# EAGLE design motadora (EAGLE 8.3.1)
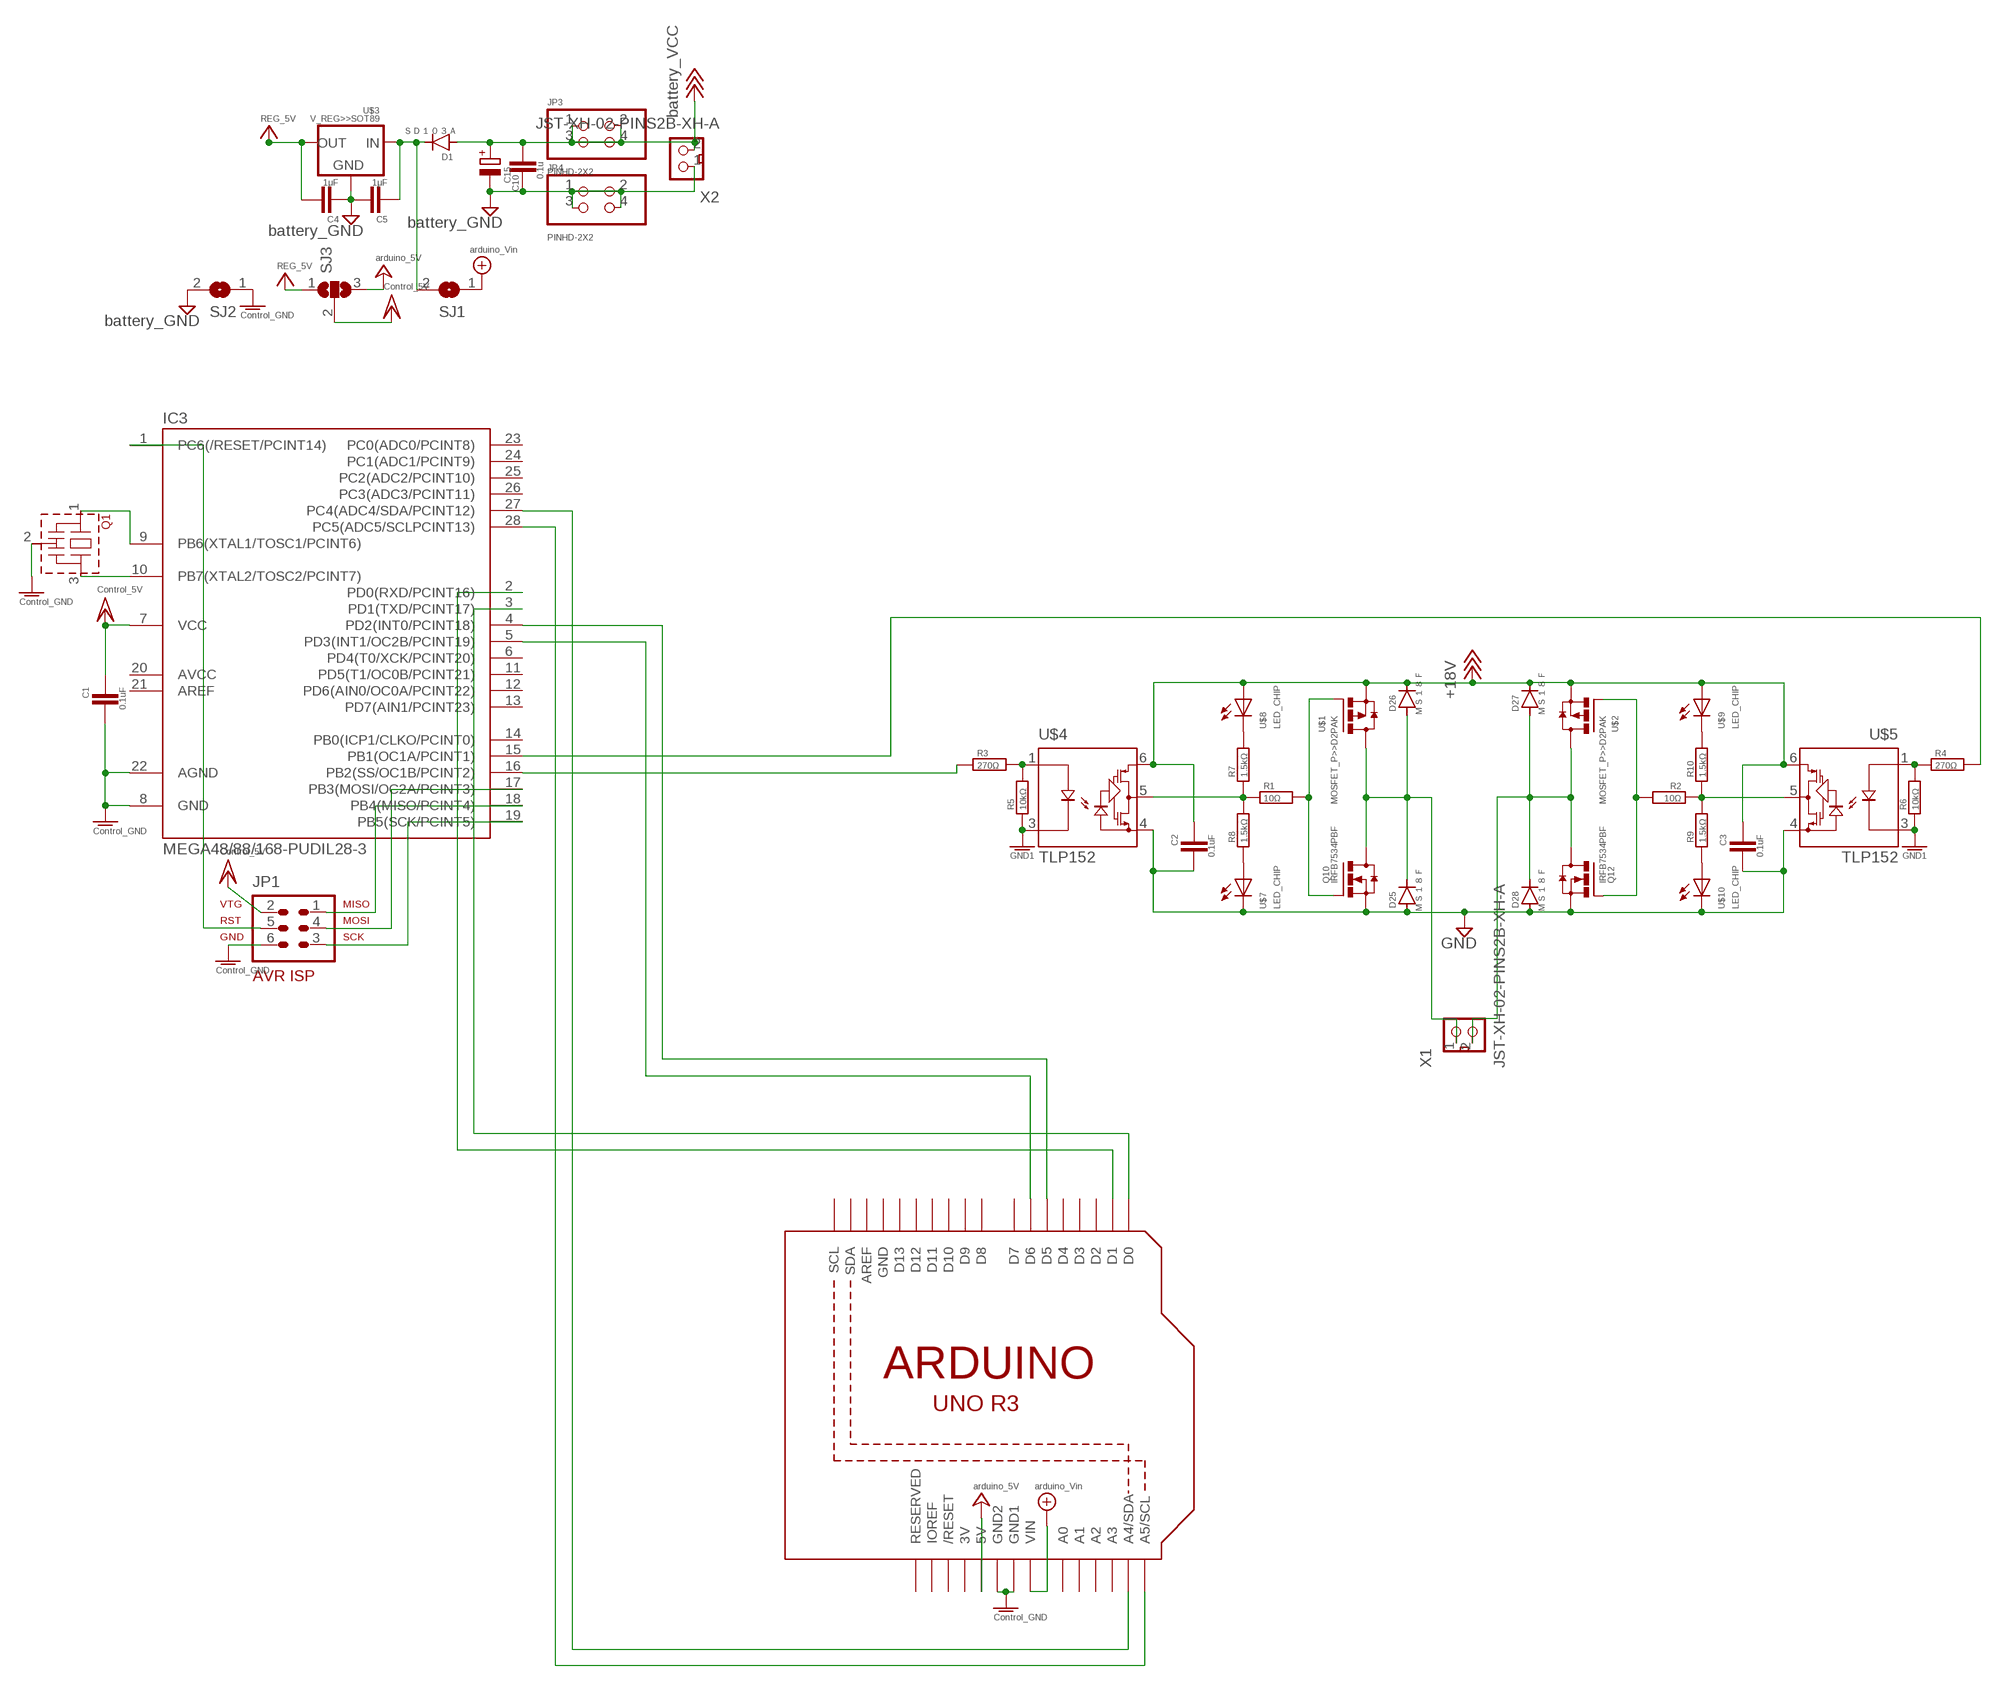
[diagram p0: schematic, sheet 1]

## Parts
C1  0.1uF  CAPACITOR>>2012  [2012]
C2  0.1uF  CAPACITOR>>2012  [2012]
C3  0.1uF  CAPACITOR>>2012  [2012]
C4  1μF  C>>C2012  [C2012]
C5  1μF  C>>C2012  [C2012]
C10  0.1u  C-EU025-025X050  [C025-025X050]
C15  CPOL-EUTT2D5L  [TT2D5L]
D1  ＳＤ１０３Ａ  DIODE>>D-7.5  [D-7.5]
D25  ＭＳ１８Ｆ  DIODE>>MS18F  [MS18F]
D26  ＭＳ１８Ｆ  DIODE>>MS18F  [MS18F]
D27  ＭＳ１８Ｆ  DIODE>>MS18F  [MS18F]
D28  ＭＳ１８Ｆ  DIODE>>MS18F  [MS18F]
IC3  MEGA48/88/168-PUDIL28-3  [DIL28-3]
JP1  AVR-ISP-6  [AVR-ISP-6]
JP3  PINHD-2X2  [2X02]
JP4  PINHD-2X2  [2X02]
Q1  CSTLS_G  [CSTLS_G8]
Q10  IRFB7534PBF  MOS-FET_N(D2PACK)  [D2PACK]
Q12  IRFB7534PBF  MOS-FET_N(D2PACK)  [D2PACK]
R1  10Ω  REGISTER>>2012  [2012]
R2  10Ω  REGISTER>>2012  [2012]
R3  270Ω  REGISTER>>2012  [2012]
R4  270Ω  REGISTER>>2012  [2012]
R5  10kΩ  REGISTER>>2012  [2012]
R6  10kΩ  REGISTER>>2012  [2012]
R7  1.5kΩ  REGISTER>>2012  [2012]
R8  1.5kΩ  REGISTER>>2012  [2012]
R9  1.5kΩ  REGISTER>>2012  [2012]
R10  1.5kΩ  REGISTER>>2012  [2012]
SJ1  SJ  [SJ]
SJ2  SJ  [SJ]
SJ3  SJ2W  [SJ_2]
U1  ARDUINOR3-BPLACE  [ARDUINOR3-BPLACE]
U$1  MOSFET_P>>D2PAK  [D2PAK]
U$2  MOSFET_P>>D2PAK  [D2PAK]
U$3  V_REG>>SOT89  [SOT89]
U$4  TLP152  [11-4L1S]
U$5  TLP152  [11-4L1S]
U$7  LED_CHIP  [2012]
U$8  LED_CHIP  [2012]
U$9  LED_CHIP  [2012]
U$10  LED_CHIP  [2012]
X1  JST-XH-02-PINS2B-XH-A  2_S2B-XH-A  [S2B-XH-A]
X2  JST-XH-02-PINS2B-XH-A  2_S2B-XH-A  [S2B-XH-A]

## Nets
+5V: C4.1 SJ3.1 U$3.1(OUT) ; supply symbol labelled REG_5V
+18V: C2.2 C3.2 C10.1 C15.+ D1.A D26.P$2(C) D27.P$2(C) JP3.1 JP3.2 JP3.3 JP3.4 U$1.3(S) U$2.3(S) U$4.6 U$5.6 U$8.P$1(A) U$9.P$1(A) X2.2 ; supply symbol labelled battery_VCC
GND: C2.1 C3.1 C4.2 C5.1 C10.2 C15.- D25.P$1(A) D28.P$1(A) JP4.1 JP4.2 JP4.3 JP4.4 Q10.3(S) Q12.3(S) SJ2.2 U$3.2(GND) U$3.2.1(GND) U$4.4 U$5.4 U$7.P$2(C) U$10.P$2(C) X2.1 ; supply symbol labelled battery_GND
GND1: C1.1 IC3.8(GND) IC3.22(AGND) JP1.6 Q1.2(VSS) R5.1 R6.1 SJ2.1 U1.GND1 U1.GND2 U$4.3 U$5.3 ; supply symbol labelled Control_GND
N$1: R2.1 R9.2 R10.1 U$5.5
N$2: Q12.1(G) R2.2 U$2.1(G)
N$3: IC3.28(PC5(ADC5/SCLPCINT13)) U1.A5(A5/SCL)
N$4: R3.2 R5.2 U$4.1
N$5: R1.1 R7.1 R8.2 U$4.5
N$6: R4.1 R6.2 U$5.1
N$7: IC3.17(PB3(MOSI/OC2A/PCINT3)) JP1.4
N$8: IC3.27(PC4(ADC4/SDA/PCINT12)) U1.A4(A4/SDA)
N$9: IC3.10(PB7(XTAL2/TOSC2/PCINT7)) Q1.3
N$10: IC3.3(PD1(TXD/PCINT17)) U1.D0
N$11: IC3.2(PD0(RXD/PCINT16)) U1.D1
N$13: C5.2 D1.C SJ1.2 U$3.3(IN)
N$15: D25.P$2(C) D26.P$1(A) Q10.2(D) U$1.4(D) X1.1
N$17: R7.2 U$8.P$2(C)
N$18: IC3.9(PB6(XTAL1/TOSC1/PCINT6)) Q1.1
N$19: R8.1 U$7.P$1(A)
N$20: IC3.1(PC6(/RESET/PCINT14)) JP1.5
N$21: Q10.1(G) R1.2 U$1.1(G)
N$22: R9.1 U$10.P$1(A)
N$23: R10.2 U$9.P$2(C)
N$24: D27.P$1(A) D28.P$2(C) Q12.2(D) U$2.4(D) X1.2
N$26: IC3.19(PB5(SCK/PCINT5)) JP1.3
N$50: IC3.4(PD2(INT0/PCINT18)) U1.D5
N$51: IC3.5(PD3(INT1/OC2B/PCINT19)) U1.D6
N$55: IC3.18(PB4(MISO/PCINT4)) JP1.1
N$57: IC3.16(PB2(SS/OC1B/PCINT2)) R3.1
N$58: IC3.15(PB1(OC1A/PCINT1)) R4.2
VCC5: SJ3.3 U1.5V ; supply symbol labelled arduino_5V
VCC6: SJ1.1 U1.VIN ; supply symbol labelled arduino_Vin
VCC7: C1.2 IC3.7(VCC) JP1.2 SJ3.2 ; supply symbol labelled Control_5V
Unconnected: IC3.6(PD4(T0/XCK/PCINT20)) IC3.11(PD5(T1/OC0B/PCINT21)) IC3.12(PD6(AIN0/OC0A/PCINT22)) IC3.13(PD7(AIN1/PCINT23)) IC3.14(PB0(ICP1/CLKO/PCINT0)) IC3.20(AVCC) IC3.21(AREF) IC3.23(PC0(ADC0/PCINT8)) IC3.24(PC1(ADC1/PCINT9)) IC3.25(PC2(ADC2/PCINT10)) IC3.26(PC3(ADC3/PCINT11)) U1.A0 U1.A1 U1.A2 U1.A3 U1.AREF U1.D2 U1.D3 U1.D4 U1.D7 U1.D8 U1.D9 U1.D10 U1.D11 U1.D12 U1.D13 U1.IOREF U1.RESERVED U1.RESET(/RESET) U1.SCL U1.SDA

## Power pins joined to a net without a drawn wire
3V: U1.3V
GND: U1.GND

## Library data of the parts
C1-C3 = !SMD:CAPACITOR>>
C4 C5 = !Capasiter:C>>: CAPACITOR, European symbol
C10 = _capasiter:C-EU: CAPACITOR, European symbol
C15 = _Capasiter(ｺﾝﾃﾞﾝｻ):CPOL-EU: POLARIZED CAPACITOR, European symbol
D1 D25-D28 = !diode(ﾀﾞｲｵｰﾄﾞ):DIODE>>: DIODE
IC3 = !avr:MEGA48/88/168-PU
JP1 = !avr:AVR-ISP-6: AVR ISP-6 Serial Programming Header
JP3 JP4 = _pinhead(ﾋﾟﾝﾍｯﾀﾞ):PINHD-2X2: PIN HEADER
Q1 = !murata-resonators(ｾﾗﾛｯｸ):CSTLS_G: Ceramic resonator 2.00 to 10.00 MHz
Q10 Q12 = _FET&transister&v-reg:MOS-FET_N
R1-R10 = !SMD:REGISTER>>
SJ1 SJ2 = jumper:SJ: SMD solder JUMPER
SJ3 = jumper:SJ2W: SMD solder JUMPER
U1 = adafruit:ARDUINOR3: This is a new object for the new Arduino R3 - with extra pins that you may want to use (such as IOref, and duplicated A4/A5
U$1 U$2 = !FET_transister_v-reg:MOSFET_P>>
U$3 = !FET_transister_v-reg:V_REG>>
U$4 U$5 = !optocoupler(ﾌｫﾄｶﾌﾟﾗ):TLP152
U$7-U$10 = !led:LED_CHIP
X1 X2 = !con-xh:2_: Wire-to-Board 2.5mm pitch top mount connector Source: http://www.jst-mfg.com/product/pdf/jpn/XH.pdf http://www.jst-mfg.com/product/detail.php?series=277

## Board
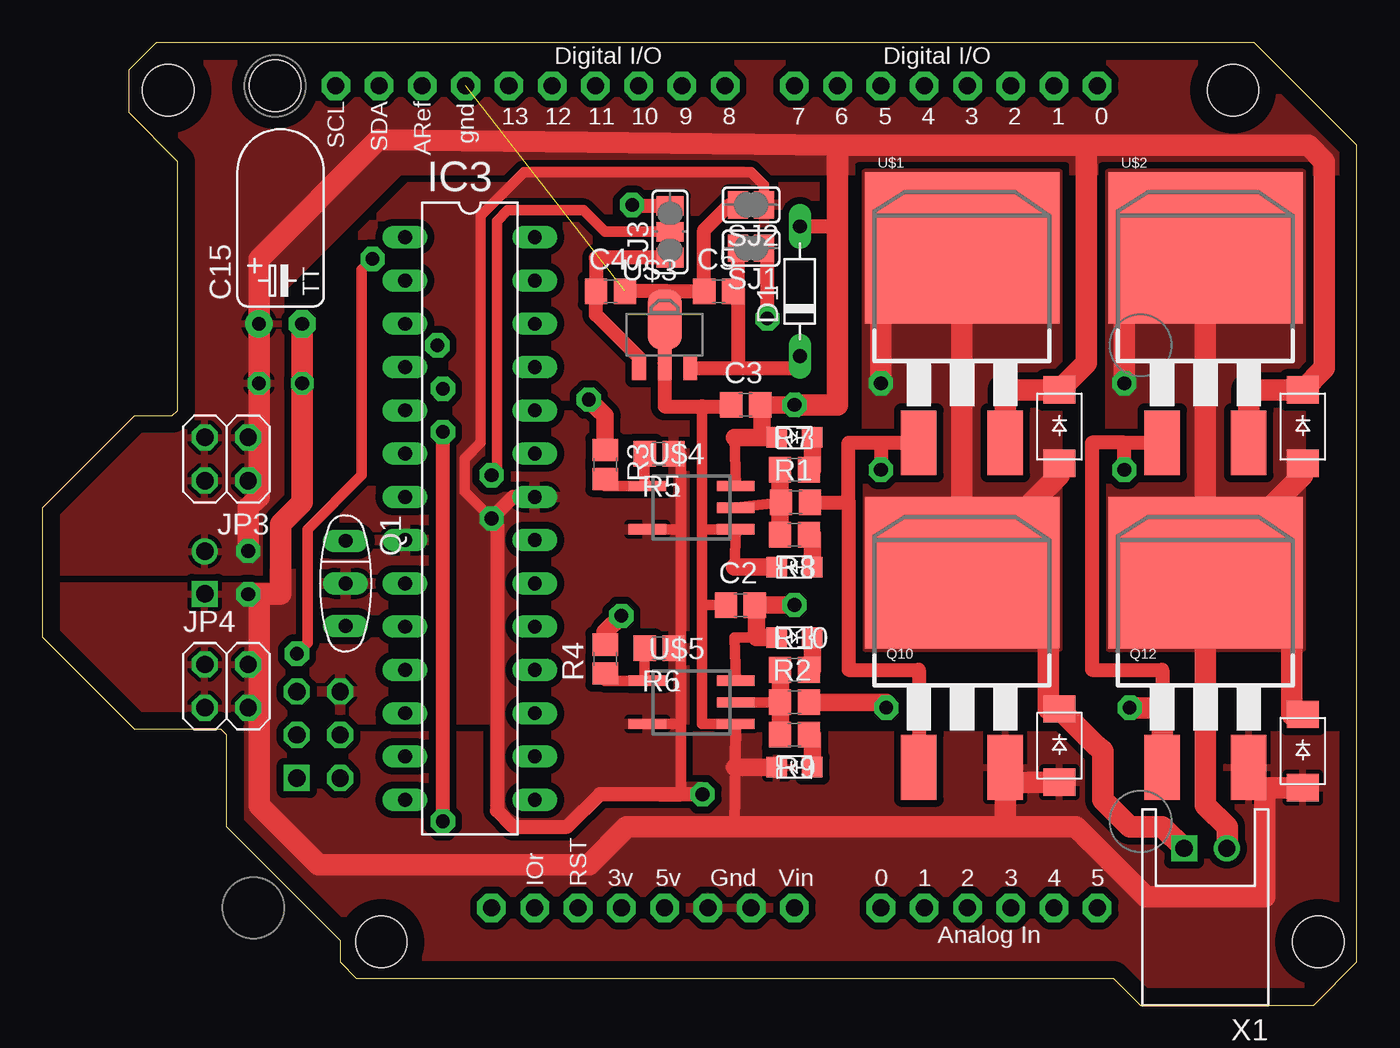
[diagram p1: board, top side]
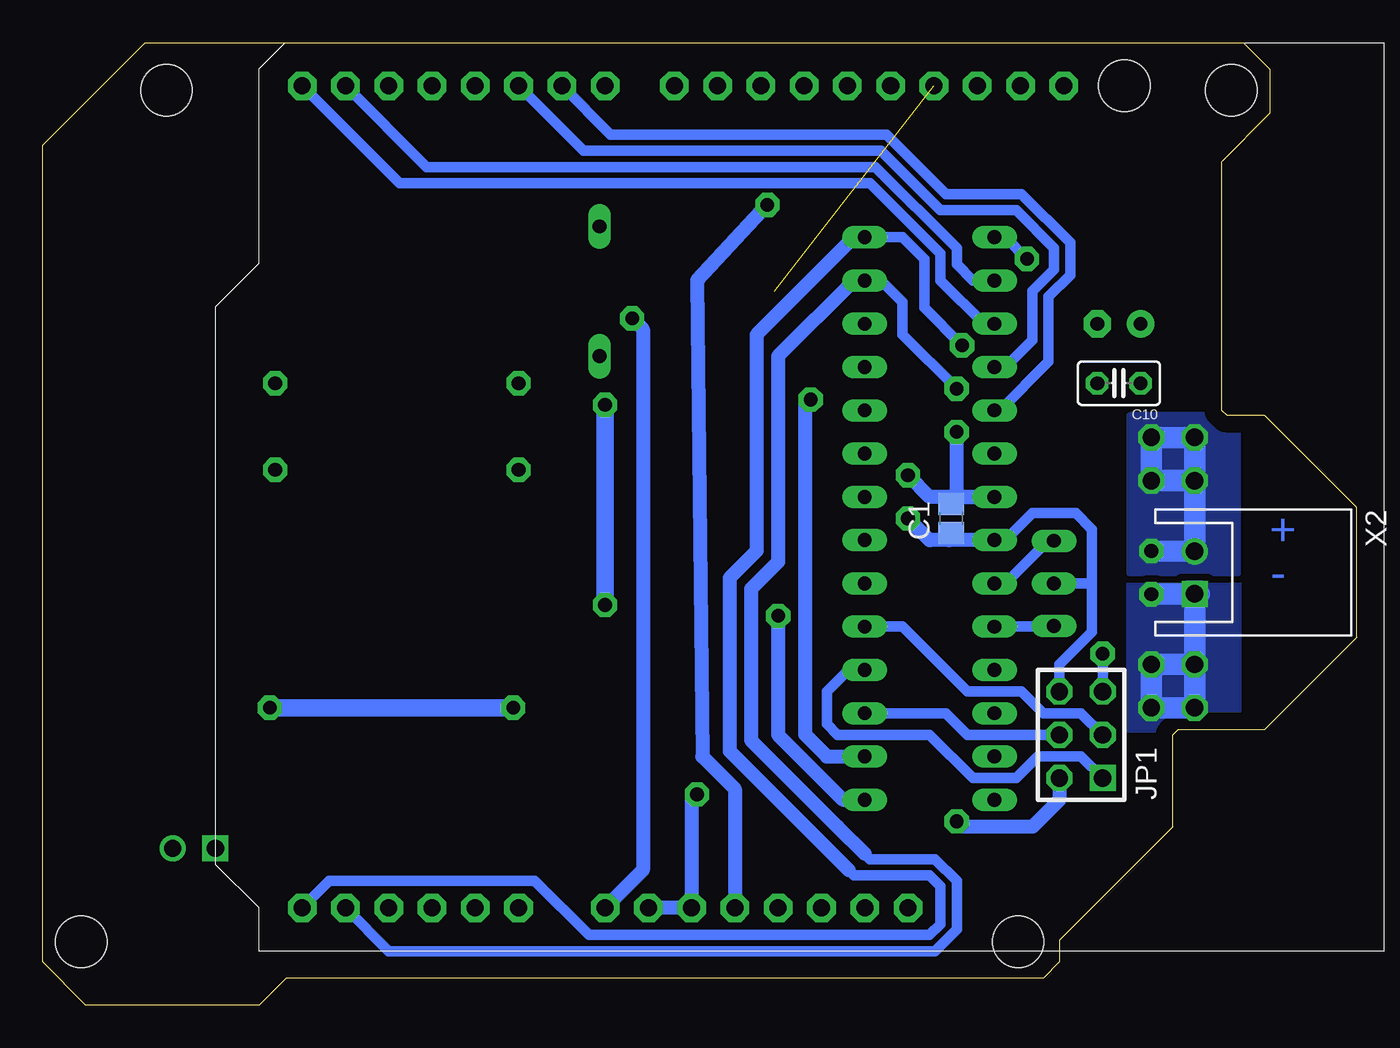
[diagram p2: board, bottom side, seen from below]

Size 77.15 x 56.52 mm. Coordinates in mm from the lower left corner, seen from the top.
Outline: 10.8,10.48 10.8,15.88 10.48,16.19 5.4,16.19 0,21.59 0,29.21 5.4,34.61 7.62,34.61 7.94,34.92 7.94,49.53 5.08,52.39 5.08,54.93 6.67,56.52 71.12,56.52 77.15,50.48 77.15,2.54 74.61,0 64.45,0 62.87,1.59 18.41,1.59 17.46,2.54 17.46,3.81 10.8,10.48
Copper layers (1*16): Top 0.035mm / dielectric 1.5mm / Bottom 0.035mm
Design rules "default *": minimum track width 10mil, minimum drill 24mil, track to track 8mil, track to pad 8mil, pad to pad 8mil, via to via 8mil, smd to smd 8mil, copper to edge 40mil, drill to drill 8mil, minimum pad ring 10mil, minimum via ring 8mil, stop-mask expansion 4mil, vias tented up to drill 0mil, thermal gap 10mil
Holes 3 mm at 13.65,53.97 74.88,3.71 69.88,53.72 7.38,53.72 19.88,3.71

### Footprints (pad centres in the part's own frame; a part is rotated, then mirrored left to right if it is on the bottom)
2012 = smd 1.3 x 1.5: 1 -0.85,0; 2 0.85,0
C2012 = smd 1.3 x 1.5: 1 -0.85,0; 2 0.85,0
C025-025X050 = drill 0.813 octagon: 1 -1.27,0; 2 1.27,0
TT2D5L = drill 0.813 pad 1.6: + -1.27,0 | drill 0.813 pad 1.6 octagon: - 1.27,0
D-7.5 = drill 0.813 long: A 3.81,0; C -3.81,0
MS18F = smd 1.6 x 1.9: P$1 -2.15,0; P$2 2.15,0
DIL28-3 = drill 0.813 long: 1 -16.51,-3.81; 2 -13.97,-3.81; 3 -11.43,-3.81; 4 -8.89,-3.81; 5 -6.35,-3.81; 6 -3.81,-3.81; 7 -1.27,-3.81; 8 1.27,-3.81; 9 3.81,-3.81; 10 6.35,-3.81; 11 8.89,-3.81; 12 11.43,-3.81; 13 13.97,-3.81; 14 16.51,-3.81; 15 16.51,3.81; 16 13.97,3.81; 17 11.43,3.81; 18 8.89,3.81; 19 6.35,3.81; 20 3.81,3.81; 21 1.27,3.81; 22 -1.27,3.81; 23 -3.81,3.81; 24 -6.35,3.81; 25 -8.89,3.81; 26 -11.43,3.81; 27 -13.97,3.81; 28 -16.51,3.81
AVR-ISP-6 = drill 1.016 square: 1 -2.54,-1.27 | drill 1.016 octagon: 2 -2.54,1.27; 3 0,-1.27; 4 0,1.27; 5 2.54,-1.27; 6 2.54,1.27
2X02 = drill 1.016 octagon: 1 -1.27,-1.27; 2 -1.27,1.27; 3 1.27,-1.27; 4 1.27,1.27
CSTLS_G8 = drill 0.813 long: 1 -2.5,0; 2 0,0; 3 2.5,0
D2PACK = smd 2.083 x 3.81: 1 -2.54,-9.525; 3 2.54,-9.525 | smd 11.43 x 8.89: 2 0,1.905
SJ = smd 1.168 x 1.6: 1 -0.762,0; 2 0.762,0
SJ_2 = smd 1.168 x 1.6: 1 -1.524,0; 2 0,0; 3 1.524,0
ARDUINOR3-BPLACE = drill 1 pad 1.676 octagon: 3V 35.56,2.54; 5V 38.1,2.54; A0 50.8,2.54; A1 53.34,2.54; A2 55.88,2.54; A3 58.42,2.54; A4 60.96,2.54; A5 63.5,2.54; AREF 23.876,50.8; D0 63.5,50.8; D1 60.96,50.8; D2 58.42,50.8; D3 55.88,50.8; D4 53.34,50.8; D5 50.8,50.8; D6 48.26,50.8; D7 45.72,50.8; D8 41.656,50.8; D9 39.116,50.8; D10 36.576,50.8; D11 34.036,50.8; D12 31.496,50.8; D13 28.956,50.8; GND 26.416,50.8; GND1 43.18,2.54; GND2 40.64,2.54; IOREF 30.48,2.54; RESERVED 27.94,2.54; RESET 33.02,2.54; SCL 18.796,50.8; SDA 21.336,50.8; VIN 45.72,2.54
D2PAK = smd 2.083 x 3.81: 1 -2.54,-8.89; 3 2.54,-8.89 | smd 11.43 x 8.89: 4 0,2.54
SOT89 = smd 0.8 x 1.4: 1 -1.499,-1.981; 3 1.499,-1.981 | smd 0.8 x 1.9: 2 0,-1.727 | smd 2 x 3.5: 2.1 0,0.889
11-4L1S = smd 0.6 x 2.2: 1 -1.27,-2.6; 3 1.27,-2.6; 4 1.27,2.6; 5 0,2.6; 6 -1.27,2.6
2012' = smd 1.2 x 1.2: P$1 -1.05,0; P$2 1.05,0
S2B-XH-A = drill 1.016 square: 1 1.25,0 | drill 1.016: 2 -1.25,0

### Placement (x,y rotation side)
C1  23.81,28.57 90 bottom
C2  40.96,23.5 0 top
C3  41.27,35.24 0 top
C4  33.34,41.91 0 top
C5  39.69,41.91 0 top
C10  13.97,36.51 180 bottom
C15  13.97,40 0 top
D1  44.45,41.91 90 top
D25  59.69,15.24 90 top
D26  59.69,33.97 90 top
D27  73.98,33.97 90 top
D28  73.98,14.92 90 top
IC3  25.08,28.57 270 top
JP1  16.19,15.88 90 bottom
JP3  10.79,32.07 180 top
JP4  10.79,18.73 0 top
Q1  17.78,24.77 270 top
Q10  53.98,23.5 0 top
Q12  68.26,23.5 0 top
R1  44.2,29.53 0 top
R2  44.13,17.78 0 top
R3  33.02,31.75 270 top
R4  33.02,20.32 90 top
R5  36.2,32.39 180 top
R6  36.2,20.95 180 top
R7  44.13,31.43 0 top
R8  44.13,27.62 180 top
R9  44.13,15.88 180 top
R10  44.13,19.69 0 top
SJ1  41.59,44.45 180 top
SJ2  41.59,46.99 180 top
SJ3  36.83,45.4 90 top
U1  -1.59,3.17 0 top
U$1  53.98,41.91 0 top
U$2  68.26,41.91 0 top
U$3  36.51,39.37 0 top
U$4  38.1,29.21 270 top
U$5  38.1,17.78 270 top
U$7  LED_CHIP  [2012']  44.13,25.72 180 top
U$8  LED_CHIP  [2012']  44.13,33.34 0 top
U$9  LED_CHIP  [2012']  44.13,21.59 0 top
U$10  LED_CHIP  [2012']  44.13,13.97 180 top
X1  68.26,9.21 180 top
X2  9.53,25.4 270 bottom

### Tracks (layer width: path | path; a pad name or v marks a point on that pad's centre or on a via)
+5V
  Top 0.813: SJ3.1 32.49,43.88 C4.1 32.49,40.54 35.01,38.01 U$3.1
+18V  (via drill 0.8 pad 1.42)
  Top 0.61: 70.8,31.82 U$2.3 | 56.52,31.82 U$1.3 | U$4.6 40.63,33.34 | 41.91,21.59 40.63,21.59 U$5.6
  Top 0.813: 46.67,46.04 46.67,45.72 D1.A
  Top 1.016: U$9.P$1 41.91,21.59 41.91,23.5 | U$8.P$1 42.22,33.34 | 42.22,33.34 40.63,33.34 | v44.13,35.24 C3.2 42.23,35.24 42.22,33.34 | 41.91,23.5 v44.13,23.5 | 41.91,23.5 C2.2
  Top 1.27: 61.28,50.48 74.3,50.48 75.25,49.53 75.25,37.39 D27.P$2 70.8,36.12 U$2.3 | 61.28,50.48 61.28,37.71 D26.P$2 56.52,36.12 U$1.3 | 61.28,50.48 46.67,50.48 | 46.67,50.48 46.67,46.04 46.67,35.24 v44.13,35.24 | 46.67,50.48 19.69,50.8 12.7,43.81 C15.+ C10.1 12.7,29.84 12.06,29.21 v12.06,26.67 | 9.53,26.67 X2.2
  Bottom 1.016: v44.13,23.5 v44.13,35.24
  Bottom 1.27: JP3.3 JP3.1 JP3.2 JP3.4 | JP3.3 JP3.4 | JP3.3 9.53,32.61 | JP3.4 9.53,31.65 | JP3.4 9.53,26.67 | v12.06,26.67 X2.2
  pour Top (isolate 0.406, rank 4): 13.97,25.4 -0.32,25.4 -0.32,56.83 77.47,56.83 77.47,48.89 20.95,48.89 13.97,41.91
  pour Bottom (isolate 0.406, rank 4, no thermals): 6.99,25.4 6.99,34.61 13.34,34.61 13.34,25.4
GND  (via drill 0.8 pad 1.42)  (1 unrouted)
  Top 0.61: 71.76,12.77 Q12.3 | 56.52,13.09 Q10.3 | U$5.4 38.72,16.51 38.72,23.5 | 38.72,27.94 U$4.4 40.63,25.72 | 38.72,27.94 38.72,35.16 | 40.63,13.97 U$5.4 | 38.72,23.5 C2.1 | 38.72,23.5 38.72,27.94 | 40.63,10.48 U$5.4
  Top 0.813: U$3.2 36.51,35.16 38.72,35.16 40.43,35.16 C3.1 | SJ2.2 40.32,46.99 38.84,45.5 C5.1 36.72,41.91 | 36.72,41.91 C4.2 | 36.72,41.91 36.83,41.8 U$3.2.1 U$3.2 | U$3.2 36.51,37.73
  Top 1.016: U$7.P$2 40.63,25.72 | 40.63,13.97 U$10.P$2
  Top 1.27: D25.P$1 56.52,13.09 | D28.P$1 71.76,12.77 71.76,6.35 64.77,6.35 60.64,10.48 56.52,10.48 | Q10.3 56.52,10.48 | 56.52,10.48 40.63,10.48 34.29,10.48 32.07,8.25 16.19,8.25 12.7,11.75 12.7,24.13 | X2.1 9.53,24.18 | 13.76,24.13 13.97,24.13 13.97,24.34 | 13.97,24.34 13.97,28.26 15.24,29.53 C10.2 C15.- | v12.06,24.13 12.7,24.13 | 12.7,24.13 13.76,24.13 | 13.76,24.13 13.97,24.34
  Bottom 1.27: JP4.2 JP4.4 JP4.3 JP4.1 | JP4.1 JP4.2 | JP4.2 9.53,24.18 9.25,24.13 v12.06,24.13 X2.1 | JP4.2 9.53,19.14 | JP4.1 9.53,18.37
  pour Top (isolate 0.406, rank 5): -0.32,-0.32 77.47,-0.32 77.47,15.88 14.92,15.88 14.92,25.4 -0.32,25.4
  pour Bottom (isolate 0.406, rank 5, no thermals): 6.99,25.4 6.99,16.19 13.34,16.19 13.34,25.4
GND1  (via drill 0.8 pad 1.42)
  Top 0.61: U$4.3 37.46,27.94 37.46,27.55 | 37.46,20.94 37.46,16.51 | 37.46,27.55 37.46,20.94 | 37.46,16.51 37.46,15.24 37.48,15.23 37.48,12.39 | 37.46,16.51 U$5.3 | SJ2.1 42.35,48.13 41.59,48.89 28.26,48.89 25.72,46.36 25.72,33.02 24.77,32.07 24.77,30.16 v26.35,28.57 | R6.1 37.45,20.95 37.46,20.94 | R5.1 37.46,32.39 37.46,27.55
  Top 0.813: v38.73,12.38 36.19,12.39 | 36.19,12.39 37.48,12.39 | 36.19,12.39 32.71,12.39 30.8,10.48 27.62,10.48 26.67,11.43 26.67,28.26 v26.35,28.57 27.62,29.84 IC3.22
  Bottom 0.61: C1.1 23.81,27.44 23.95,27.3 | 15.56,24.77 Q1.2 | 15.56,24.77 15.56,27.94 16.51,28.89 19.05,28.89 20.64,27.3 IC3.8 | 15.56,24.77 15.56,21.91 17.46,20 JP1.6
  Bottom 0.813: v38.73,12.38 39.05,12.06 U1.GND2 U1.GND1 | v26.35,28.57 25.08,27.3 23.95,27.3 IC3.8
  pour Top (isolate 0.406, rank 6): -0.63,56.83 -0.32,-0.32 77.79,-0.32 77.47,56.83
N$1
  Top 0.61: 43.3,17.78 U$5.5
  Top 0.813: R2.1 43.3,17.78
  Top 1.016: R9.2 43.3,15.88 43.3,17.78 43.3,19.37 R10.1
N$2  (via drill 0.8 pad 1.42)
  Top 0.813: 63.5,33.02 61.59,33.02 61.59,19.69 65.72,19.69 65.72,17.46 65.72,15.05 | 63.5,33.02 U$2.1 | v63.5,31.43 63.5,33.02
  Top 1.016: Q12.1 65.72,15.05 | v49.53,17.46 49.53,17.78 R2.2
  Top 1.27: 65.72,12.8 Q12.1 65.72,17.46 v63.82,17.46
  Bottom 1.016: v49.53,17.46 v63.82,17.46
N$3  (via drill 0.8 pad 1.42)
  Bottom 0.61: IC3.28 26.67,45.08 25.4,43.81 25.4,40.96 v23.18,38.73 | 29.84,7.94 29.53,7.62 25.08,7.62 24.45,6.98 24.45,4.76 25.08,4.13 45.09,4.13 48.26,7.3 60.33,7.3 U1.A5
  Bottom 0.813: IC3.28 29.53,45.08 35.24,39.37 35.24,26.67 36.83,25.08 36.83,14.92 29.84,7.94
N$4
  Top 0.61: R3.2 33.02,30.48 U$4.1 35.34,30.48 R5.2
N$5
  Top 0.61: 43.28,29.53 U$4.5
  Top 0.813: R1.1 43.28,29.53
  Top 1.016: R8.2 43.28,29.53 R7.1
N$6
  Top 0.61: R6.2 35.34,19.2 U$5.1 33.02,19.05 R4.1
N$7
  Bottom 0.61: JP1.4 22.86,15.88 24.13,17.14 IC3.17
N$8  (via drill 0.8 pad 1.42)
  Bottom 0.61: IC3.27 27.94,42.55 26.67,41.28 26.67,39.37 v23.5,36.2 | U1.A4 56.83,3.17 24.77,3.17 23.5,4.45 23.5,7.3 24.77,8.57 28.57,8.57 28.89,8.89
  Bottom 0.813: IC3.27 29.53,42.55 33.97,38.1 33.97,26.04 35.56,24.45 35.56,15.56 30.48,10.48 28.89,8.89
N$9
  Bottom 0.61: IC3.10 17.78,22.23 Q1.3
N$10
  Bottom 0.61: IC3.3 21.91,40 24.45,42.55 24.45,44.13 28.57,48.26 56.2,48.26 U1.D0
N$11
  Bottom 0.61: IC3.2 22.54,42.55 23.5,43.5 23.5,44.45 28.26,49.21 54.61,49.21 U1.D1
N$13
  Top 0.61: C5.2 40.76,41.91 40.83,41.98
  Top 0.813: D1.C 44.45,37.39 40.83,37.39 | SJ1.2 40.83,41.98 40.83,37.39 | 40.83,37.39 U$3.3
N$15  (via drill 0.8 pad 1.42)
  Top 1.27: 53.98,29.32 U$1.4 49.21,44.45 v49.21,36.51 | 53.98,29.32 Q10.2 59.05,25.4 59.05,17.39 D25.P$2 61.84,15.24 62.23,14.92 62.23,12.06 63.82,10.48 65.72,10.48 X1.1 | D26.P$1 59.69,31.11 57.79,29.21 54.08,29.21 53.98,29.32
  pour Top (isolate 0.406, no thermals): 48.26,48.89 48.26,20.95 59.69,20.95 59.69,48.89
N$17
  Top 1.016: R7.2 45.18,31.43 U$8.P$2
N$18
  Bottom 0.61: Q1.1 18.14,27.27 20.64,24.77 IC3.9
N$19
  Top 1.016: R8.1 45.18,27.62 U$7.P$1
N$20  (via drill 0.8 pad 1.42)
  Top 0.61: v19.37,43.81 18.73,43.18 18.73,31.11 15.56,27.94 15.56,21.27 v14.92,20.64
  Bottom 0.61: IC3.1 20.64,45.08 v19.37,43.81 | v14.92,20.64 JP1.5
N$21  (via drill 0.8 pad 1.42)
  Top 0.61: 51.44,12.66 Q10.1
  Top 0.813: 49.21,33.02 U$1.1 | 49.21,33.02 47.31,33.02 47.31,29.53 | 47.31,29.53 47.31,19.69 51.44,19.69 Q10.1 | R1.2 47.31,29.53 | 49.21,33.02 v49.21,31.43
N$22
  Top 1.016: R9.1 45.18,15.88 U$10.P$1
N$23
  Top 1.016: R10.2 45.18,19.69 U$9.P$2
N$24  (via drill 0.8 pad 1.42)
  Top 0.61: U$2.4 68.26,43.55 | Q12.2 63.5,25.4 63.5,29.37
  Top 1.27: D28.P$2 73.34,17.07 73.34,25.4 Q12.2 | 68.26,29.41 Q12.2 | 68.26,29.41 68.26,43.55 | 68.26,29.41 68.46,29.21 72.07,29.21 73.98,31.11 D27.P$1 73.98,31.75 | Q12.2 68.26,21.59 | X1.2 69.53,9.21 69.53,10.48 68.26,11.75 Q12.2 | v63.5,36.51 63.5,44.45 U$2.4
  pour Top (isolate 0.406, no thermals): 62.55,48.89 62.55,20.95 73.98,20.95 73.98,48.89
N$26
  Bottom 0.61: JP1.3 16.19,17.14 18.41,17.14 19.69,18.41 22.86,18.41 26.67,22.23 IC3.19
N$50
  Bottom 0.61: IC3.4 20.64,37.47 19.05,39.05 19.05,41.91 17.78,43.18 17.78,44.45 20,46.67 24.45,46.67 27.94,50.17 45.4,50.17 U1.D5
N$51
  Bottom 0.61: IC3.5 20.95,34.92 18.1,37.78 18.1,41.59 16.83,42.86 16.83,44.77 19.69,47.62 24.13,47.62 27.62,51.12 43.82,51.12 U1.D6
N$55
  Bottom 0.61: JP1.1 16.19,14.61 18.73,14.61 20,13.34 22.54,13.34 25.08,15.88 30.48,15.88 31.12,16.51 31.12,18.41 29.84,19.69 IC3.18
N$57  (via drill 0.8 pad 1.42)
  Top 1.016: 32.7,34.92 v32.07,35.56 33.02,34.61 R3.1
  Bottom 0.813: IC3.16 31.12,14.61 32.39,15.88 32.39,35.24 v32.07,35.56
N$58  (via drill 0.8 pad 1.42)
  Top 1.016: R4.2 33.02,21.91 v33.97,22.86
  Bottom 0.813: v33.97,22.86 33.97,15.88 30.16,12.06 IC3.15
VCC5  (via drill 0.8 pad 1.42)
  Top 0.813: SJ3.3 34.54,46.93 v34.61,46.99
  Bottom 0.813: v34.61,46.99 38.73,42.55 38.42,14.61 36.51,12.7 U1.5V
VCC6  (via drill 0.8 pad 1.42)
  Top 0.813: v42.55,40.32 42.55,44.45 SJ1.1
  Bottom 0.813: v42.55,40.32 41.91,39.69 41.91,7.94 U1.VIN
VCC7  (via drill 0.8 pad 1.42)
  Top 0.61: SJ3.2 33.02,45.4 31.75,46.67 27.3,46.67 26.67,46.04 26.67,31.43 v26.35,31.11
  Top 0.813: v23.5,33.66 v23.5,10.79
  Bottom 0.61: C1.2 23.81,29.82 23.78,29.84
  Bottom 0.813: v26.35,31.11 25.08,29.84 23.78,29.84 IC3.7 23.5,29.84 v23.5,33.66 | JP1.2 17.46,12.06 19.05,10.48 23.18,10.48 v23.5,10.79

### Text on the board
Bottom: + | -